# Altium schematic sheet Ethernet_Adapter.SchDoc
size Tabloid; SheetNumber: 1; SheetTotal: 1; Time: Ethernet Adapter
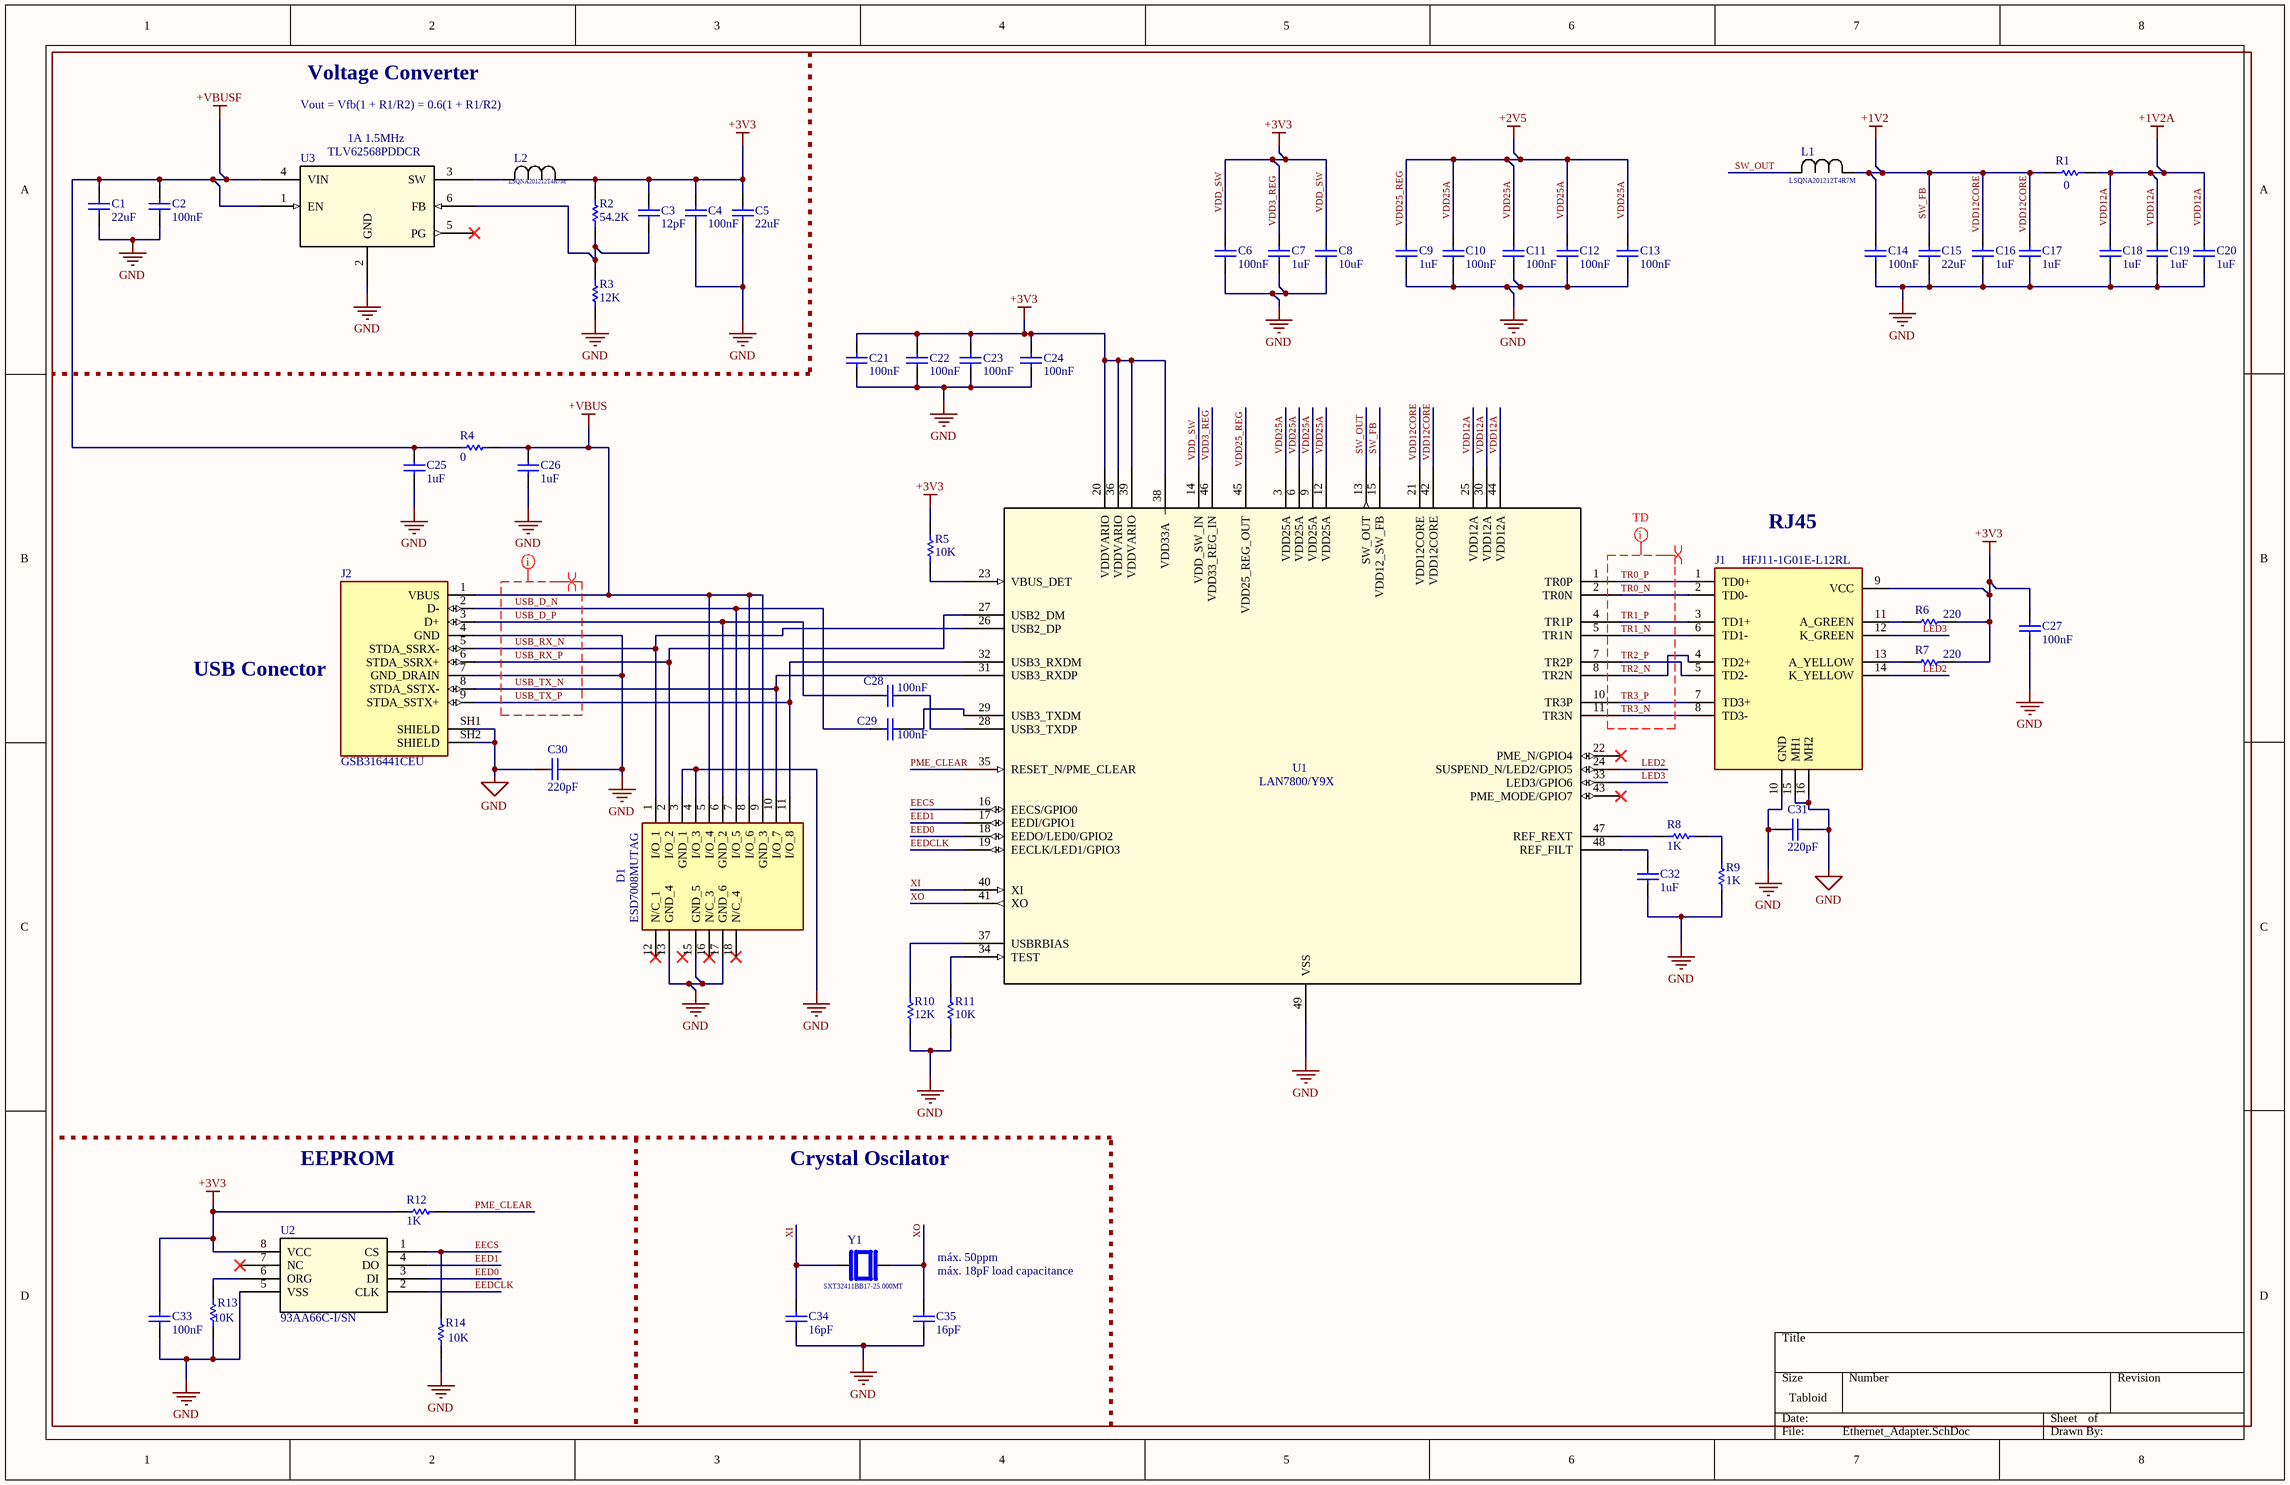
[diagram p0: Ethernet_Adapter.SchDoc]

## Parts
C1  22uF  [Capacitor 0603]
C2  100nF  [Capacitor 0402]
C3  12pF  [Capacitor 0402]
C4  100nF  [Capacitor 0402]
C5  22uF  [Capacitor 0603]
C6  100nF  [Capacitor 0402]
C7  1uF  [Capacitor 0402]
C8  10uF  [Capacitor 0402]
C9  1uF  [Capacitor 0402]
C10  100nF  [Capacitor 0402]
C11  100nF  [Capacitor 0402]
C12  100nF  [Capacitor 0402]
C13  100nF  [Capacitor 0402]
C14  100nF  [Capacitor 0402]
C15  22uF  [Capacitor 0402]
C16  1uF  [Capacitor 0402]
C17  1uF  [Capacitor 0402]
C18  1uF  [Capacitor 0402]
C19  1uF  [Capacitor 0402]
C20  1uF  [Capacitor 0402]
C21  100nF  [Capacitor 0402]
C22  100nF  [Capacitor 0402]
C23  100nF  [Capacitor 0402]
C24  100nF  [Capacitor 0402]
C25  1uF  [Capacitor 0402]
C26  1uF  [Capacitor 0402]
C27  100nF  [Capacitor 0402]
C28  100nF  [Capacitor 0402]
C29  100nF  [Capacitor 0402]
C30  220pF  [Capacitor 0402]
C31  220pF  [Capacitor 0402]
C32  1uF  [Capacitor 0402]
C33  100nF  [Capacitor 0402]
C34  16pF  [Capacitor 0402]
C35  16pF  [Capacitor 0402]
D1  ESD7008MUTAG  [ESD7008MUTAG]
J1  HFJ11-1G01E-L12RL  [HFJ111G01EL12RL]
J2  GSB316441CEU  [AMPHENOL_GSB316441CEU]
L1  LSQNA201212T4R7M  [IND_LSQN_A201212_TAY]
L2  LSQNA201212T4R7M  [IND_LSQN_A201212_TAY]
R1  0  [Resistencia 0402]
R2  54.2K  [Resistencia 0402]
R3  12K  [Resistencia 0402]
R4  0  [Resistencia 0402]
R5  10K  [Resistencia 0402]
R6  220  [Resistencia 0402]
R7  220  [Resistencia 0402]
R8  1K  [Resistencia 0402]
R9  1K  [Resistencia 0402]
R10  12K  [Resistencia 0402]
R11  10K  [Resistencia 0402]
R12  1K  [Resistencia 0402]
R13  10K  [Resistencia 0402]
R14  10K  [Resistencia 0402]
U1  LAN7800/Y9X  [SQFN48_7X7_Y9X_MCH]
U2  93AA66C-I/SN  [SOIC8-N_MC_MCH]
U3  TLV62568PDDCR  [DDC0006A_TEX]
Y1  SXT32411BB17-25.000MT  [XTAL_SXT32411BB17-25.000MT]

## Nets
+VBUS: C26.2 D1.5(I/O_4) D1.8(I/O_6) D1.9(GND_3) J2.1(VBUS) R4.2(B)
+VBUSF: C1.2 C2.2 C25.2 R4.1(A) U3.1(EN) U3.4(VIN)
GND: C1.1 C2.1 C4.1 C5.1 C6.1 C7.1 C8.1 C9.1 C10.1 C11.1 C12.1 C13.1 C14.1 C15.1 C16.1 C17.1 C18.1 C19.1 C20.1 C21.1 C22.1 C23.1 C24.1 C25.1 C26.1 C27.1 C30.1 C30.2 C31.1 C31.2 C32.1 C33.1 C34.1 C35.1 D1.3(GND_1) D1.4(I/O_3) D1.13(GND_4) D1.15(GND_5) D1.17(GND_6) J1.10(GND) J1.15(MH1) J1.16(MH2) J2.4(GND) J2.7(GND_DRAIN) J2.SH1(SHIELD) J2.SH2(SHIELD) R3.1(A) R9.1(A) R10.1(A) R11.1(A) R13.1(A) R14.1(A) U1.49(VSS) U2.5(VSS) U3.2(GND)
SW_FB: C14.2 C15.2 C16.2 C17.2 L1.1 R1.1(A) U1.15(VDD12_SW_FB) U1.21(VDD12CORE) U1.42(VDD12CORE)  [also labelled +1V2, VDD12CORE]
VDD3_REG: C3.2 C4.2 C5.2 C6.2 C7.2 C8.2 C21.2 C22.2 C23.2 C24.2 C27.2 C33.2 J1.9(VCC) L2.1 R2.2(B) R5.2(B) R6.2(B) R7.2(B) R12.1(A) U1.14(VDD_SW_IN) U1.20(VDDVARIO) U1.36(VDDVARIO) U1.38(VDD33A) U1.39(VDDVARIO) U1.46(VDD33_REG_IN) U2.8(VCC)  [also labelled +3V3, VDD_SW]
VDD12A: C18.2 C19.2 C20.2 R1.2(B) U1.25(VDD12A) U1.30(VDD12A) U1.44(VDD12A)  [also labelled +1V2A]
VDD25_REG: C9.2 C10.2 C11.2 C12.2 C13.2 U1.3(VDD25A) U1.6(VDD25A) U1.9(VDD25A) U1.12(VDD25A) U1.45(VDD25_REG_OUT)  [also labelled +2V5, VDD25A]
EECS: R14.2(B) U1.16(EECS/GPIO0) U2.1(CS)
EED0: U1.18(EEDO/LED0/GPIO2) U2.3(DI)
EED1: U1.17(EEDI/GPIO1) U2.4(DO)
EEDCLK: U1.19(EECLK/LED1/GPIO3) U2.2(CLK)
LED2: J1.14(K_YELLOW) U1.24(SUSPEND_N/LED2/GPIO5)
LED3: J1.12(K_GREEN) U1.33(LED3/GPIO6)
PME_CLEAR: R12.2(B) U1.35(RESET_N/PME_CLEAR)
SW_OUT: L1.2 U1.13(SW_OUT)
TR0_N: J1.2(TD0-) U1.2(TR0N)
TR0_P: J1.1(TD0+) U1.1(TR0P)
TR1_N: J1.6(TD1-) U1.5(TR1N)
TR1_P: J1.3(TD1+) U1.4(TR1P)
TR2_N: J1.4(TD2+) U1.8(TR2N)
TR2_P: J1.5(TD2-) U1.7(TR2P)
TR3_N: J1.8(TD3-) U1.11(TR3N)
TR3_P: J1.7(TD3+) U1.10(TR3P)
USB_D_N: C29.2 D1.7(I/O_5) J2.2(D-)
USB_D_P: C28.2 D1.6(GND_2) J2.3(D+)
USB_RX_N: D1.1(I/O_1) J2.5(STDA_SSRX-) U1.26(USB2_DP)
USB_RX_P: D1.2(I/O_2) J2.6(STDA_SSRX+) U1.27(USB2_DM)
USB_TX_N: D1.10(I/O_7) J2.8(STDA_SSTX-) U1.31(USB3_RXDP)
USB_TX_P: D1.11(I/O_8) J2.9(STDA_SSTX+) U1.32(USB3_RXDM)
XI: C34.2 U1.40(XI) Y1.3
XO: C35.2 U1.41(XO) Y1.1
NetC3_1: C3.1 R2.1(A) R3.2(B) U3.6(FB)
NetC28_1: C28.1 U1.28(USB3_TXDP)
NetC29_1: C29.1 U1.29(USB3_TXDM)
NetC32_2: C32.2 U1.48(REF_FILT)
NetJ1_11: J1.11(A_GREEN) R6.1(A)
NetJ1_13: J1.13(A_YELLOW) R7.1(A)
NetL2_2: L2.2 U3.3(SW)
NetR5_1: R5.1(A) U1.23(VBUS_DET)
NetR8_1: R8.1(A) U1.47(REF_REXT)
NetR8_2: R8.2(B) R9.2(B)
NetR10_2: R10.2(B) U1.37(USBRBIAS)
NetR11_2: R11.2(B) U1.34(TEST)
NetR13_2: R13.2(B) U2.6(ORG)

Not connected (* = marked no-connect by the designer): D1 12(N/C_1)* 16(N/C_3)* 18(N/C_4)*; U1 22(PME_N/GPIO4)* 43(PME_MODE/GPIO7)*; U2 7(NC)*; U3 5(PG)*

## Layout directives
mark named TD: TR0_N, TR0_P, TR1_N, TR1_P, TR2_N, TR2_P, TR3_N, TR3_P
differential pair; differential pair class 100_OHM_DIFF: TR0_N, TR0_P, TR1_N, TR1_P, TR2_N, TR2_P, TR3_N, TR3_P
mark named USB: USB_D_N, USB_D_P, USB_RX_N, USB_RX_P, USB_TX_N, USB_TX_P
differential pair; differential pair class 90_OHM_DIFF: USB_D_N, USB_D_P, USB_RX_N, USB_RX_P, USB_TX_N, USB_TX_P

## Notes on the sheet
- Voltage Converter
- Vout = Vfb(1 + R1/R2) = 0.6(1 + R1/R2)
- (near U3) 1A 1.5MHz
- (near J1) RJ45
- USB Conector
- EEPROM
- Crystal Oscilator
- máx. 50ppm
- (near C35) máx. 18pF load capacitance

## Library data of the parts
C1 C5 = Capacitor 0603: Capacitor Ceramico SMD 0603
C2-C4 C6-C35 = Capacitor 0402: Capacitor Ceramico SMD 0402
D1 = ESD7008MUTAG: 10V Clamp Ipp Tvs Diode Surface Mount 18-UDFN (5.5x1.5); Manufacturer_Name: onsemi; Geometry.Height: 0.55mm; Mouser Part Number: 863-ESD7008MUTAG; Mouser Price/Stock: https://www.mouser.co.uk/ProductDetail/onsemi/ESD7008MUTAG?qs=Gud3nhECO%2Fs1qvAxYTTX5w%3D%3D; Manufacturer_Part_Number: ESD7008MUTAG; Datasheet Link: http://www.onsemi.com/pub/Collateral/ESD7008-D.PDF
J1 = HFJ11-1G01E-L12RL: Modular Connectors / Ethernet Connectors GIGABIT 1x1 Tab Down RJ45 w/mag Y/G LED 350uH min 0C ~ 70C; Manufacturer_Name: Halo Electronics; Geometry.Height: 15.64mm; Mouser Part Number: 493-HFJ111G01EL12RL; Mouser Price/Stock: https://www.mouser.co.uk/ProductDetail/HALO-Electronics/HFJ11-1G01E-L12RL?qs=8uu3sA0mUdsaxIpTwn1s5A%3D%3D; Manufacturer_Part_Number: HFJ11-1G01E-L12RL; Datasheet Link: https://www.haloelectronics.com/pdf/fastjack-gigabit.pdf
J2 = GSB316441CEU: USB 3.2, Type A, Plug, Right Angle SMT, 9 Pins, Offset 0.95mm, 3.2mm Height, Shell Dip with Nickel Plating, 30&mu;in Gold, Blue High Temperature Housing, Tape and Reel Packaging; MF: Amphenol; SnapEDA_Link: https://www.snapeda.com/parts/GSB316441CEU/Amphenol/view-part/?ref=snap; Package: None; Value: *; MP: GSB316441CEU; Check_prices: https://www.snapeda.com/parts/GSB316441CEU/Amphenol/view-part/?ref=eda
L1 L2 = LSQNA201212T4R7M: 4.7 µH Semiblindado Bobinado de alambre enrollado Inductivo 300 mA 520mOhm máx. 0805 (2012 métrico); Manufacturer_Name: Taiyo Yuden; Copyright: Copyright (C) 2025 Ultra Librarian. All rights reserved.; Manufacturer_Part_Number: LSQNA201212T4R7M
R1-R14 = Resistencia SMD 0402
U1 = LAN7800Y9X: Description; Manufacturer_Name: Microchip; Copyright: Copyright (C) 2025 Ultra Librarian. All rights reserved.; Manufacturer_Part_Number: LAN7800/Y9X; RefDes: RefDes; Type: Type
U2 = 93AA66C-ISN: IC EEPROM 4KBIT MICROWIRE 8SOIC; Manufacturer_Name: Microchip; Copyright: Copyright (C) 2026 Ultra Librarian. All rights reserved.; Manufacturer_Part_Number: 93AA66C-I/SN; RefDes: RefDes; Type: Type
U3 = TLV62568PDDCR: 2.5V-5.5V input, 1A high efficiency step-down buck converter in SOT23 and SOT563 package 6-SOT-23-THIN -40 to 125; Manufacturer_Name: Texas Instruments; Type: Power Management; Copyright: Copyright (C) 2026 Ultra Librarian. All rights reserved.; Manufacturer_Part_Number: TLV62568PDDCR; RefDes: RefDes
Y1 = SXT32411BB17-25.000MT: MF: {'manufacturer': u'Suntsu Electronics, Inc'}; Package: None; Price: None; Value: *; MP: SXT32411BB17-25.000MT; Availability: Unavailable